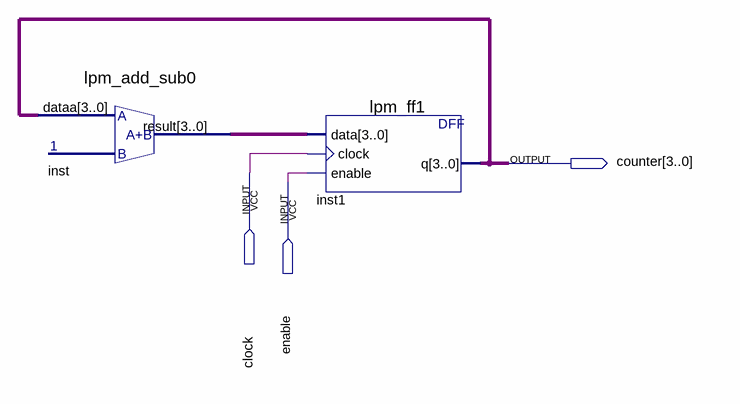
[diagram p0: schematic sheet]
// Quartus schematic Datapath.bdf as structural Verilog: 2 symbols, 3 pins
module Datapath (
  input  clock,
  input  enable,
  output [3:0] counter
);

  wire [3:0] inst_result;

  lpm_add_sub0 inst (.dataa(counter), .result(inst_result));
  lpm_ff1 inst1 (.data(inst_result), .clock(clock), .enable(enable), .q(counter));
endmodule
